# Altium schematic sheet 心率设计.SchDoc
size A4
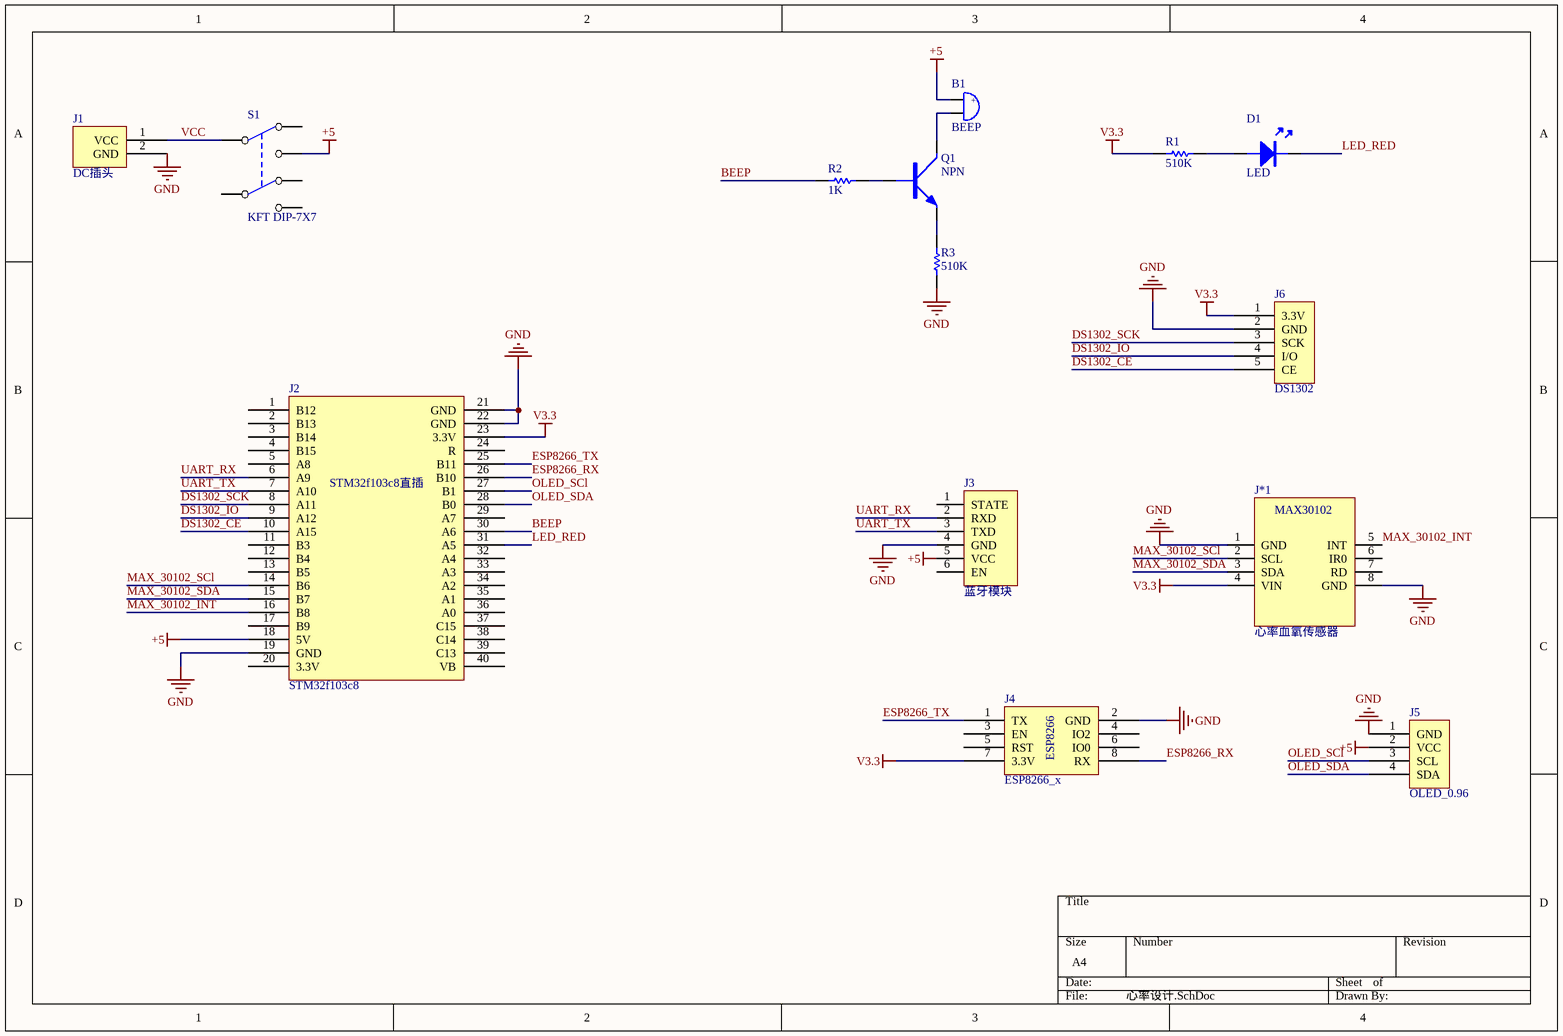
[diagram p0: 心率设计.SchDoc]

## Parts
B1  BEEP  [BEEP 7.6X12X9.5]
D1  LED  [LED3-RED]
J1  DC插头  [DC插头]
J2  STM32f103c8  [STM32C8t6DIP封装1]
J3  蓝牙模块  [HC_05]
J4  ESP8266_x  [ESP8266]
J5  OLED_0.96  [OLED_0.96]
J6  DS1302  [Fe-HDR1X5/2.54-S]
J*1  心率血氧传感器  [MAX30102]
Q1  NPN  [SOT-23]
R1  510K  [0603R]
R2  1K  [0603R]
R3  510K  [0603R]
S1  KFT DIP-7X7  [KFT DIP-7X7]

## Nets
+5: B1.1 J2.18(5V) J3.5(VCC) J5.2(VCC) S1.1
GND: J1.2(GND) J2.19(GND) J2.21(GND) J2.22(GND) J3.4(GND) J4.2(GND) J5.1(GND) J6.2(GND) J*1.1(GND) J*1.8(GND) R3.1
V3.3: J2.23(3.3V) J4.7(3.3V) J6.1(3.3V) J*1.4(VIN) R1.1
BEEP: J2.30(A6) R2.2
DS1302_CE: J2.10(A15) J6.5(CE)
DS1302_IO: J2.9(A12) J6.4(I/O)
DS1302_SCK: J2.8(A11) J6.3(SCK)
ESP8266_RX: J2.26(B10) J4.8(RX)
ESP8266_TX: J2.25(B11) J4.1(TX)
LED_RED: D1.K J2.31(A5)
MAX_30102_INT: J2.16(B8) J*1.5(INT)
MAX_30102_SCl: J2.14(B6) J*1.2(SCL)
MAX_30102_SDA: J2.15(B7) J*1.3(SDA)
OLED_SCl: J2.27(B1) J5.3(SCL)
OLED_SDA: J2.28(B0) J5.4(SDA)
UART_RX: J2.6(A9) J3.2(RXD)
UART_TX: J2.7(A10) J3.3(TXD)
VCC: J1.1(VCC) S1.2
NetB1_2: B1.2 Q1.C
NetD1_A: D1.A R1.2
NetQ1_B: Q1.B R2.1
NetQ1_E: Q1.E R3.2

Not connected (* = marked no-connect by the designer): J2 1(B12) 2(B13) 3(B14) 4(B15) 5(A8) 11(B3) 12(B4) 13(B5) 17(B9) 20(3.3V) 24(R) 29(A7) 32(A4) 33(A3) 34(A2) 35(A1) 36(A0) 37(C15) 38(C14) 39(C13) 40(VB); J3 1(STATE) 6(EN); J4 3(EN) 4(IO2) 5(RST) 6(IO0); J*1 6(IR0) 7(RD); S1 3 4 5 6

## Notes on the sheet
- (in symbol BEEP) +
- (in symbol ESP8266_1) ESP8266
- (in symbol STM32f103c8) STM32f103c8直插

## Library data of the parts
B1 = BEEP: 蜂鸣器
J2 = STM32f103c8: stm32最小系统板
J3 = HC_05: HC_05蓝牙模块
J4 = ESP8266_1
J*1 = MAX30102: 心率血氧传感器MAX30102
Q1 = NPN: NPN三极管
R1-R3 = RES